# Altium schematic sheet Power Selection - Power Supply.SchDoc: Title
size B; Organization: Midnight Sun Solar Rayce Car Team; Address1: University of Waterloo; Address2: 200 University Ave W; Address3: Waterloo, ON, Canada; Address4: N2L 3E9; Website: www.uwmidsun.com; ProjectName: ProjectName
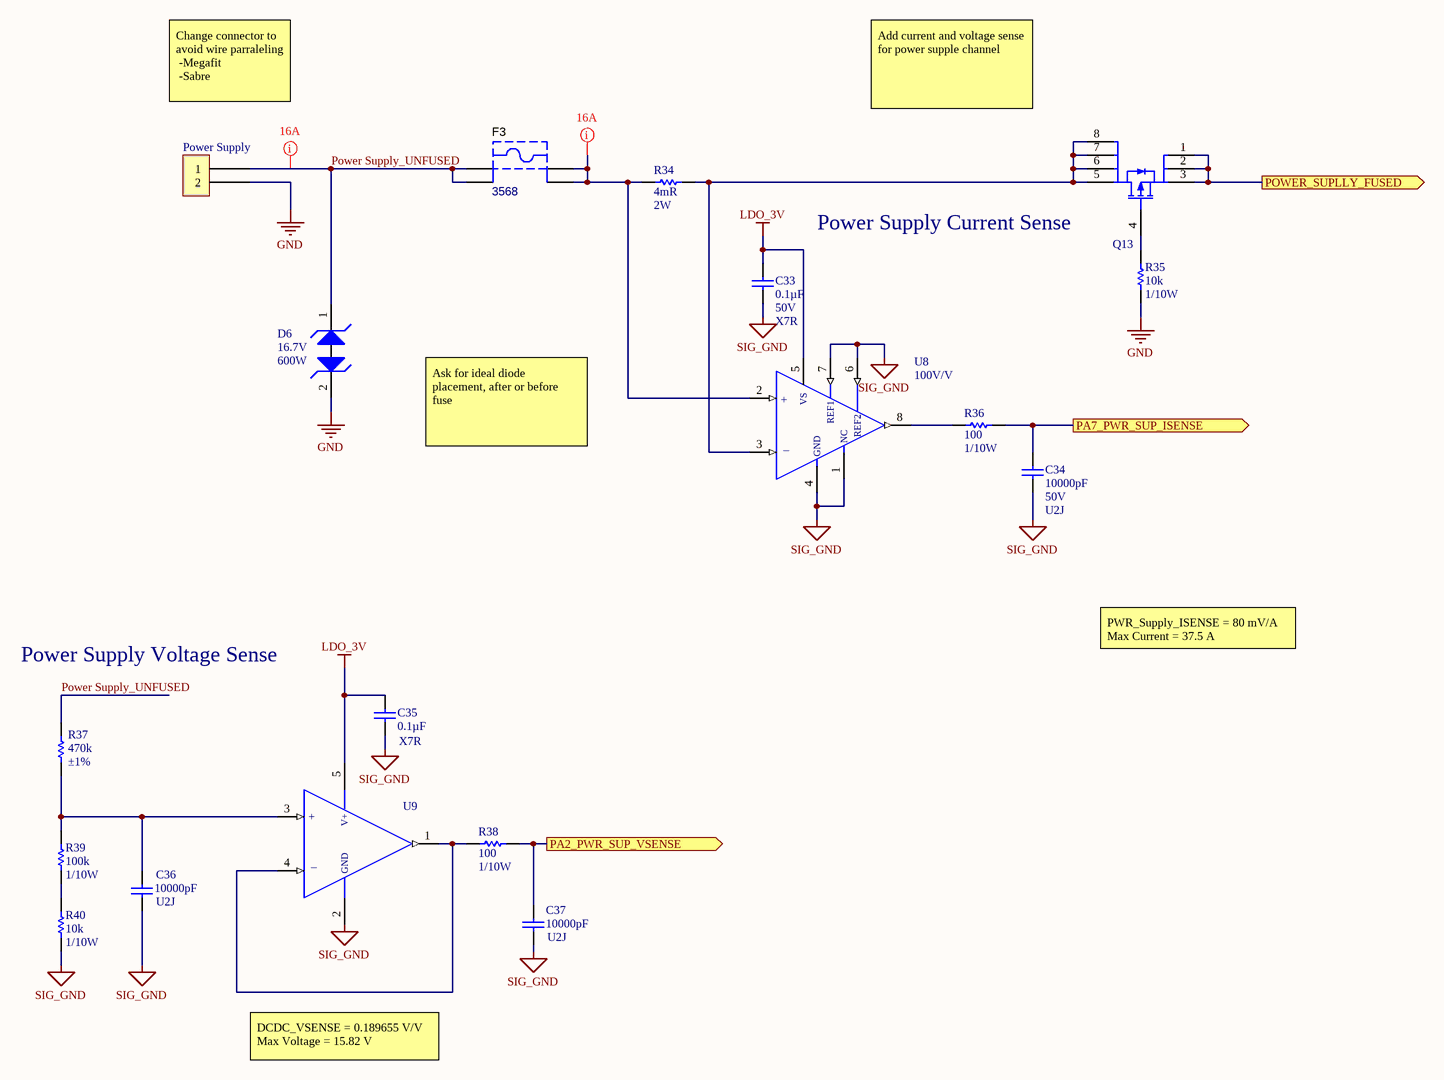
[diagram p0: Power Selection - Power Supply.SchDoc]

## Parts
C33  Capacitance: 0.1µF  Voltage: 50V  Temperature Coefficient: X7R  [CAP, 0603]  (hidden comment: CAP CER 0.1UF 50V 10% X7R 0603)
C34  Capacitance: 10000pF  Voltage: 50V  Temperature Coefficient: U2J  [CAP, 0603]  (hidden comment: CAP CER 10nF 50V 5% X7R 0603)
C35  Capacitance: 0.1µF  Temperature Coefficient: X7R  [CAP, 0603]  (hidden comment: CAP CER 0.1UF 50V 10% X7R 0603)
C36  Capacitance: 10000pF  Temperature Coefficient: U2J  [CAP, 0603]  (hidden comment: CAP CER 10nF 50V 5% X7R 0603)
C37  Capacitance: 10000pF  Temperature Coefficient: U2J  [CAP, 0603]  (hidden comment: CAP CER 10nF 50V 5% X7R 0603)
D6  Voltage - Breakdown (Min): 16.7V  Power - Peak Pulse: 600W  [DO-214AA Diode]  (hidden comment: DIODE TVS 15VWM 24.4VC DO-214AA (SMB))
F3  3568  [KSTN-3568_V]
Power_Supply  CONN HEADER TE  ELCON Mini 2POS PCB  [CONN HEADER TE  ELCON Mini 2POS PCB-Footprint-1]  (value not drawn)
Q13  MOSFET P-CH PWR56 40V 4.9 MOHM  [PMOS PWR56 40V 4.9 MOHM]  (value not drawn)
R34  Resistance: 4mR  Power (Watts): 2W  [RES 2010]  (hidden comment: RES 4m OHM 1% 2W 2010)
R35  Resistance: 10k  Power: 1/10W  [RES, 0603]  (hidden comment: RES 10K OHM 1% 1/10W 0603)
R36  Resistance: 100  Power: 1/10W  [RES, 0603]  (hidden comment: RES 100 OHM 1% 1/10W 0603)
R37  Resistance: 470k  Tolerance: ±1%  [RES, 0603]  (hidden comment: RES 470K OHM 1% 1/4W 0603)
R38  Resistance: 100  Power: 1/10W  [RES, 0603]  (hidden comment: RES 100 OHM 1% 1/10W 0603)
R39  Resistance: 100k  Power: 1/10W  [RES, 0603]  (hidden comment: RES 100K OHM 5% 1/8W 0603)
R40  Resistance: 10k  Power: 1/10W  [RES, 0603]  (hidden comment: RES 10K OHM 1% 1/10W 0603)
U8  100V/V  [IC CURRENT AMPLIFIER INA240 TSSOP-8]
U9  IC OP AMP GEN PURPOSE RR 10MHZ SOT-23-5  [IC OP AMP GP RR 10MHZ SOT-23-5]  (value not drawn)

## Ports
PA2_PWR_SUP_VSENSE (out), PA7_PWR_SUP_ISENSE (out), POWER_SUPLLY_FUSED (out)

## Nets
GND: D6.2(Cathode2) Power_Supply.2 R35.2
LDO_3V: C33.1 C35.1 U8.5(VS) U9.5(VDD)
SIG_GND: C33.2 C34.2 C35.2 C36.2 C37.2 R40.2 U8.1(NC) U8.4(GND) U8.6(REF2) U8.7(REF1) U9.2(VSS)
PA2_PWR_SUP_VSENSE: C37.1 R38.2 ; port PA2_PWR_SUP_VSENSE
PA7_PWR_SUP_ISENSE: C34.1 R36.2 ; port PA7_PWR_SUP_ISENSE
Power Supply_UNFUSED: D6.1(Cathode1) F3.1 F3.2 Power_Supply.1 R37.1
POWER_SUPLLY_FUSED: Q13.1(S) Q13.2(S) Q13.3(S) ; port POWER_SUPLLY_FUSED
NetC36_1: C36.1 R37.2 R39.1 U9.3(+IN)
NetF3_3: F3.3 F3.4 R34.1 U8.2(+IN)
NetQ13_4: Q13.4(G) R35.1
NetQ13_5: Q13.5(D) Q13.6(D) Q13.7(D) Q13.8(D) R34.2 U8.3(-IN)
NetR36_1: R36.1 U8.8(OUTPUT)
NetR38_1: R38.1 U9.1(OUTPUT) U9.4(-IN)
NetR39_2: R39.2 R40.1

## Layout directives
net class HighCurrent; rule Power Plane Connect Style [Style - Direct Connect]; rule Polygon Connect Style [Style - Direct Connect]: NetF3_3, Power Supply_UNFUSED

## Notes on the sheet
- Change connector to avoid wire parraleling
  -Megafit
  -Sabre
- Add current and voltage sense for power supple channel
- (near Q13) Power Supply Current Sense
- Ask for ideal diode placement, after or before fuse
- PWR_Supply_ISENSE = 80 mV/A
  Max Current = 37.5 A
- Power Supply Voltage Sense
- DCDC_VSENSE = 0.189655 V/V
  Max Voltage = 15.82 V
- PROJECT
- DOCUMENT
- DRAWN BY
- LAST MODIFIED
- PART NUMBER
- REVISION
- SHEET
- VARIANT
- OF
- Engineering 5 - 1002
  University of Waterloo
  (519) 888-4567 x32978
  hardware@uwmidsun.com
- (in symbol IC CURRENT AMPLIFIER INA240 8-TSSOP) +; _
- (in symbol IC OP AMP GEN PURPOSE RR 10MHZ SOT-23-5) V+; +; GND; _

## Library data of the parts
C33 C35 = CAP CER 0.1UF 50V 10% X7R 0603: 0.10µF ±10% 50V Ceramic Capacitor X7R 0603 (1608 Metric); Manufacturer 1: AVX Corporation; Manufacturer Part Number 1: 06035C104KAT2A; Supplier 1: Digi-Key; Supplier Part Number 1: 478-5052-1-ND; Packaging: Cut Tape (CT); Part Status: Active; Operating Temperature: -55°C ~ 125°C; Ratings: -; Mounting Type: Surface Mount, MLCC; Package / Case: 0603 (1608 Metric); Size / Dimension: 0.063" L x 0.032" W (1.60mm x 0.81mm); Height - Seated (Max): -; Thickness (Max): 0.035" (0.90mm); Lead Spacing: -; Lead Style: -; ComponentLink1URL: http://datasheets.avx.com/X7RDielectric.pdf; ComponentLink1Description: http://datasheets.avx.com/X7RDielectric.pdf; Tolerance: ±10%
  C35: Voltage: 50V
C34 C36 C37 = CAP CER 10nF 50V 5% X7R 0603: 10000pF ±5% 50V Ceramic Capacitor U2J 0603 (1608 Metric); Manufacturer 1: KEMET; Manufacturer Part Number 1: C0603C103J5JAC7867; Supplier 1: Digi-Key; Supplier Part Number 1: 399-13384-1-ND; Packaging: Cut Tape (CT); Part Status: Active; Operating Temperature: -55°C ~ 125°C; Ratings: -; Failure Rate: -; Mounting Type: Surface Mount, MLCC; Package / Case: 0603 (1608 Metric); Size / Dimension: 0.063" L x 0.032" W (1.60mm x 0.80mm); Height - Seated (Max): -; Thickness (Max): 0.034" (0.87mm); Lead Spacing: -; Lead Style: -; ComponentLink1URL: http://www.kemet.com/docfinder?Partnumber=C0603C103J5JAC7867; ComponentLink1Description: http://www.kemet.com/docfinder?Partnumber=C0603C103J5JAC7867; Tolerance: ±5%
  C36 C37: Voltage: 50V
D6 = DIODE TVS 15VWM 24.4VC DO-214AA (SMB): TVS DIODE 15VWM 24.4VC SMB; Manufacturer 1: Fairchild/ON Semiconductor; Manufacturer Part Number 1: SMBJ15CA; Type: Zener; Voltage - Reverse Standoff (Typ): 15V; Voltage - Clamping (Max) @ Ipp: 24.4V; Current - Peak Pulse (10/1000µs): 24.6A; Power Line Protection: No; Supplier 1: Digi-Key; Supplier Part Number 1: SMBJ15CAFSCT-ND; RoHS: RoHS Compliant; Description 1: TVS DIODE 15VWM 24.4VC SMB; Category: Circuit Protection; Stock 1: 24965; Pricing 1: 1=0.54, 10=0.444, 100=0.3027, 500=0.22704, 1000=0.17028 (CAD); Packaging: Cut Tape (CT); Part Status: Active; Applications: General Purpose; Capacitance @ Frequency: -; Operating Temperature: -55°C ~ 150°C (TJ); Mounting Type: Surface Mount; Package / Case: DO-214AA, SMB; Supplier Device Package: DO-214AA (SMB); ComponentLink1URL: https://www.fairchildsemi.com/datasheets/SM/SMBJ10CA.pdf; ComponentLink1Description: https://www.fairchildsemi.com/datasheets/SM/SMBJ10CA.pdf
F3 = CMP-005-00014-1: Fuse Holder 20A 500VAC Pin Through Hole; Illumination Type: Illuminated; Number of Poles: 1; Voltage: 500V; Color: Black; Approvals: UL; Fuse Type: Automotive; Body Material: Nylon; Material: Brass,Tin,Nylon; Fuse Current: 20A; REACH SVHC: No SVHC; Depth: 6.73mm; Current Rating: 20A; Length: 16mm; Flammability Rating: UL94 V-0; Mount: PCB,Vertical; Voltage Rating (AC): 500V; Contact Plating: Tin; Max Operating Temperature: 145°C; Min Operating Temperature: -50°C; Lead Free: Lead Free; Package Quantity: 1; Number of Circuits: 1; Termination: PC Pin; Orientation: Vertical; Contact Material: Brass,Tin
Power_Supply = CMP-002-00071-4: CONN HEADER 2POS PCB; Contact Current Rating: 40A; Number of Contacts: 2; Pitch: 7.8mm; Contact Retention: Yes (With); Sealable: No (Without); Current Rating: 45A; Circuit Application: Power; Gender: Male; Connector Type: Pin; PCB Mounting Orientation: Vertical; Number of Ports: 1; Connector System: Wire-to-Board; Number of Rows: 1; Contact Plating: Silver; Housing Color: Black; Length: 18.9mm; Package Quantity: 150; Number of Terminals: 4; Orientation: Straight; REACH SVHC: Unknown; Contact Material: Copper Alloy,Copper; Housing Material: Polymer; Depth: 10.2mm; Row Spacing: 7.8mm; Termination: Through Hole; Min Operating Temperature: -40°C; Number of Positions: 2; Contact Gender: Male; Packaging: Tape and Reel; Mount: Through Hole; Number of Power Positions: 2; Radiation Hardening: No; Flammability Rating: UL94 V-0; Max Operating Temperature: 125°C
Q13 = MOSFET P-CH PWR56 40V 4.9 MOHM: P-Channel 16V 2.5A (Ta) 650mW (Ta) Surface Mount X2-DFN2015-3; Current - Continuous Drain (Id) @ 25°C: 80A (Tc); Drive Voltage (Max Rds On,  Min Rds On): 4.5V, 10V; Vgs(th) (Max) @ Id: 3V @ 250µA; Gate Charge (Qg) (Max) @ Vgs: 107nC @ 10V; Input Capacitance (Ciss) (Max) @ Vds: 4840pF @ 20V; Power Dissipation (Max): 214W (Tj); Rds On (Max) @ Id, Vgs: 4.9mOhm @ 80A, 10V; Packaging: Cut Tape (CT); Part Status: Active; FET Type: P-Channel; Technology: MOSFET (Metal Oxide); Drain to Source Voltage (Vdss): 40V; Vgs (Max): ±16V; FET Feature: -; Operating Temperature: -55°C ~ 175°C (TJ); Mounting Type: Surface Mount; Supplier Device Package: FDWS9508L-F085OSCT-ND; Package / Case: 8-PowerTDFN; ComponentLink1URL: https://www.onsemi.com/pub/Collateral/FDWS9508L-F085-D.PDF; ComponentLink1Description: https://www.onsemi.com/pub/Collateral/FDWS9508L-F085-D.PDF; Supplier 1: Digi-Key; Supplier Part Number 1: FDWS9508L-F085OSCT-ND
R34 = RES 4m OHM 1% 2W 2010: 4 mOhms ±1% 2W Chip Resistor 2010 (5025 Metric) Automotive AEC-Q200, Current Sense Metal Element; Supplier 1: Digi-Key; Supplier Part Number 1: 2019-TLR2HWDTE4L00F75CT-ND
R35 R40 = RES 10K OHM 1% 1/10W 0603: RES SMD 10K OHM 1% 1/10W 0603; Manufacturer 1: Yageo; Manufacturer Part Number 1: RC0603FR-0710KL; Temperature Coefficient: ±100ppm/°C; Supplier 1: Digi-Key; Supplier Part Number 1: 311-10.0KHRCT-ND; Packaging: Cut Tape (CT); Part Status: Active; Composition: Thick Film; Operating Temperature: -55°C ~ 155°C; Package / Case: 0603 (1608 Metric); Supplier Device Package: 0603; Size / Dimension: 0.063" L x 0.031" W (1.60mm x 0.80mm); Height - Seated (Max): 0.022" (0.55mm); Failure Rate: -; ComponentLink1URL: http://www.yageo.com/documents/recent/PYu-RC_Group_51_RoHS_L_7.pdf; ComponentLink1Description: http://www.yageo.com/documents/recent/PYu-RC_Group_51_RoHS_L_7.pdf; Tolerance: ±1%
R36 R38 = RES 100 OHM 1% 1/10W 0603: 100 Ohm ±1% 0.1W, 1/10W Chip Resistor 0603 (1608 Metric) Moisture Resistant Thick Film; Manufacturer 1: Yageo; Manufacturer Part Number 1: RC0603FR-07100RL; Temperature Coefficient: ±100ppm/°C; Supplier 1: Digi-Key; Supplier Part Number 1: 311-100HRCT-ND; Packaging: Cut Tape (CT); Part Status: Active; Composition: Thick Film; Operating Temperature: -55°C ~ 155°C; Package / Case: 0603 (1608 Metric); Supplier Device Package: 0603; Size / Dimension: 0.063" L x 0.031" W (1.60mm x 0.80mm); Height - Seated (Max): 0.022" (0.55mm); Failure Rate: -; ComponentLink1URL: http://www.yageo.com/documents/recent/PYu-RC_Group_51_RoHS_L_7.pdf; ComponentLink1Description: http://www.yageo.com/documents/recent/PYu-RC_Group_51_RoHS_L_7.pdf; Tolerance: ±1%
R37 = RES 470K OHM 1% 1/4W 0603: RES SMD 470K OHM 1% 1/4W 0603; Manufacturer 1: Panasonic Electronic Components; Manufacturer Part Number 1: ERJ-PA3F4703V; Temperature Coefficient: ±100ppm/°C; Supplier 1: Digi-Key; Supplier Part Number 1: P470KBYCT-ND; Packaging: Cut Tape (CT); Part Status: Active; Composition: Thick Film; Operating Temperature: -55°C ~ 155°C; Package / Case: 0603 (1608 Metric); Supplier Device Package: 0603; Size / Dimension: 0.063" L x 0.031" W (1.60mm x 0.80mm); Height - Seated (Max): 0.022" (0.55mm); Failure Rate: -; ComponentLink1URL: https://industrial.panasonic.com/cdbs/www-data/pdf/RDO0000/AOA0000C291.pdf; ComponentLink1Description: https://industrial.panasonic.com/cdbs/www-data/pdf/RDO0000/AOA0000C291.pdf
R39 = RES 100K OHM 5% 1/8W 0603: RES SMD 100K OHM 5% 1/10W 0603; Manufacturer 1: Yageo; Manufacturer Part Number 1: RC0603JR-07100KL; Temperature Coefficient: ±100ppm/°C; Supplier 1: Digi-Key; Supplier Part Number 1: 311-100KGRCT-ND; Packaging: Cut Tape (CT); Part Status: Active; Composition: Thick Film; Operating Temperature: -55°C ~ 155°C; Package / Case: 0603 (1608 Metric); Supplier Device Package: 0603; Size / Dimension: 0.063" L x 0.031" W (1.60mm x 0.80mm); Height - Seated (Max): 0.022" (0.55mm); Failure Rate: -; ComponentLink1URL: http://www.yageo.com/documents/recent/PYu-RC_Group_51_RoHS_L_7.pdf; ComponentLink1Description: http://www.yageo.com/documents/recent/PYu-RC_Group_51_RoHS_L_7.pdf; Tolerance: ±5%
U8 = IC CURRENT AMPLIFIER INA240 8-TSSOP: Current Sense Amplifier 1 Circuit 8-TSSOP; Manufacturer 1: Texas Instruments; Manufacturer Part Number 1: INA240A3PWR; Description 1: IC AMP CURRENT SENSE 8-TSSOP; Slew Rate: 2 V/µs; Current - Supply: 1.8mA; Voltage - Supply, Single/Dual (±): 2.7 V ~ 5.5 V; Supplier 1: Digi-Key; Supplier Part Number 1: 296-45090-1-ND; RoHS: RoHS Compliant; Category: Integrated Circuits (ICs); Stock 1: 1286; Pricing 1: 1=3.79, 10=3.397, 100=2.7311, 500=2.24388, 1000=1.85921 (CAD); Packaging: Cut Tape (CT); Part Status: Active; Amplifier Type: Current Sense; Output Type: -; Operating Temperature: -40°C ~ 125°C; Mounting Type: Surface Mount; Package / Case: 8-TSSOP (0.173", 4.40mm Width); Supplier Device Package: 8-TSSOP; ComponentLink1URL: http://www.ti.com/lit/ds/symlink/ina240.pdf; ComponentLink1Description: http://www.ti.com/lit/ds/symlink/ina240.pdf
U9 = IC OP AMP GEN PURPOSE RR 10MHZ SOT-23-5: General Purpose Amplifier 1 Circuit Rail-to-Rail SOT-23-5; Manufacturer 1: Texas Instruments; Manufacturer Part Number 1: TLV316QDBVRQ1; Description 1: IC OP AMP GP RR 10MHZ 5-SOT-23; Number of Circuits: 1; Slew Rate: 6 V/µs; Current - Supply: 400µA; Current - Output / Channel: 50mA; Voltage - Supply, Single/Dual (±): 1.8 V ~ 5.5 V, ±0.9 V ~ 2.75 V; Supplier 1: Digi-Key; Supplier Part Number 1: 296-45323-1-ND; RoHS: RoHS Compliant; Category: Integrated Circuits (ICs); Stock 1: 1747; Pricing 1: 1=1.33, 10=1.185, 100=0.9234, 500=0.76276, 1000=0.60218 (CAD); Packaging: Cut Tape (CT); Part Status: Active; Amplifier Type: General Purpose; Output Type: Rail-to-Rail; -3db Bandwidth: -; Operating Temperature: -40°C ~ 125°C; Mounting Type: Surface Mount; Package / Case: SC-74A, SOT-753; Supplier Device Package: SOT-23-5; ComponentLink1URL: http://www.ti.com/lit/ds/symlink/tlv316-q1.pdf; ComponentLink1Description: http://www.ti.com/lit/ds/symlink/tlv316-q1.pdf